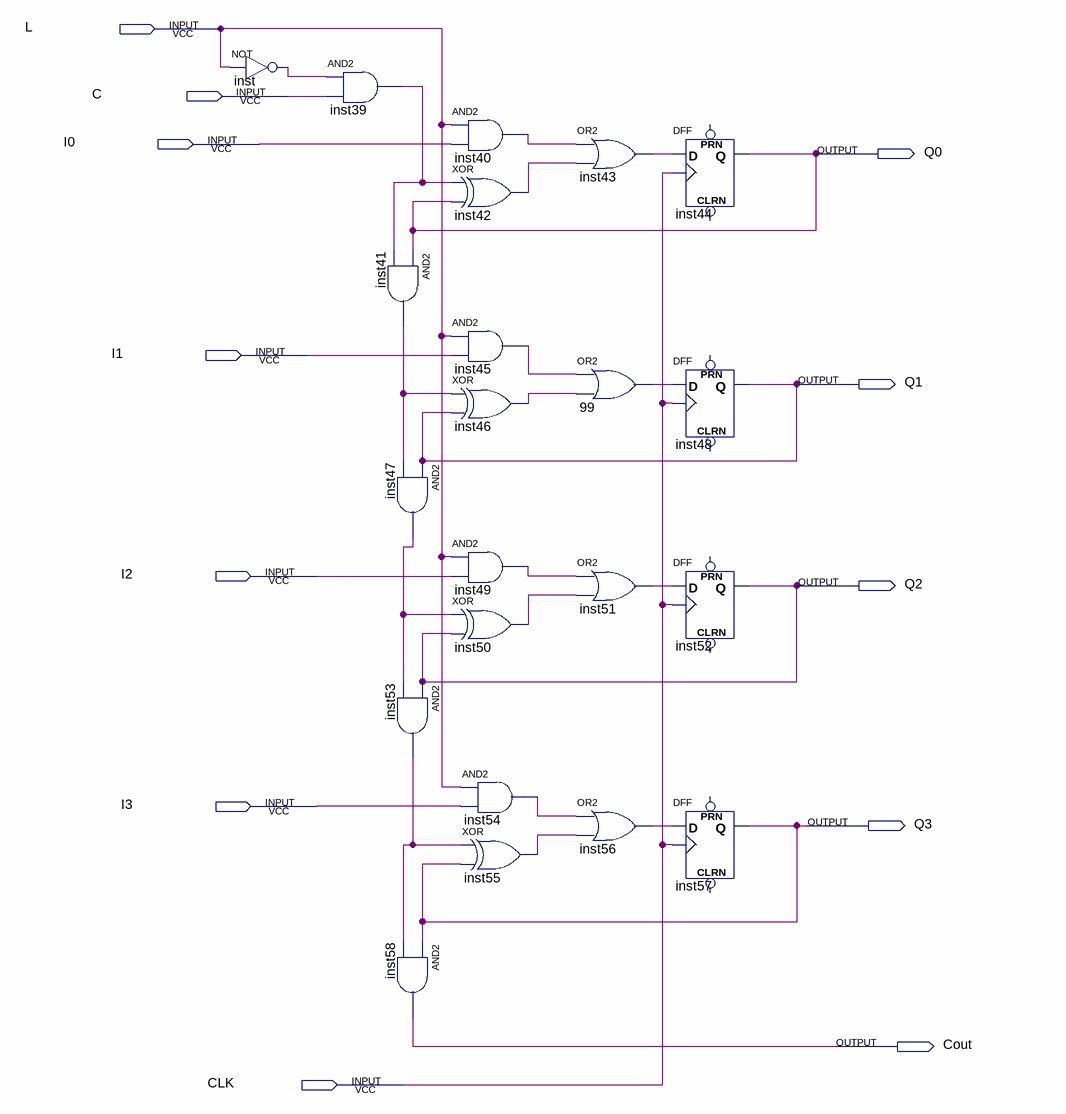
[diagram p0: schematic sheet]
// Quartus schematic binarydowncounter.bdf as structural Verilog: 22 symbols, 12 pins
module binarydowncounter (
  input  L,
  input  C,
  input  I0,
  input  I1,
  input  I2,
  input  I3,
  input  CLK,
  output Q0,
  output Q1,
  output Q2,
  output Q3,
  output Cout
);

  wire inst39_out, inst40_out, inst41_out, inst42_out, inst43_out, inst45_out, inst46_out, inst47_out,
       inst49_out, inst50_out, inst51_out, inst53_out, inst54_out, inst55_out, inst56_out, inst_out, n99_out;

  not inst (inst_out, L);
  and inst39 (inst39_out, inst_out, C);
  and inst41 (inst41_out, Q0, inst39_out);
  and inst47 (inst47_out, Q1, inst41_out);
  and inst53 (inst53_out, Q2, inst47_out);
  and inst58 (Cout, Q3, inst53_out);
  and inst40 (inst40_out, L, I0);
  xor inst42 (inst42_out, inst39_out, Q0);
  and inst45 (inst45_out, L, I1);
  xor inst46 (inst46_out, inst41_out, Q1);
  and inst49 (inst49_out, L, I2);
  xor inst50 (inst50_out, inst47_out, Q2);
  and inst54 (inst54_out, L, I3);
  xor inst55 (inst55_out, inst53_out, Q3);
  or inst43 (inst43_out, inst40_out, inst42_out);
  or u_99 (n99_out, inst45_out, inst46_out);
  or inst51 (inst51_out, inst49_out, inst50_out);
  or inst56 (inst56_out, inst54_out, inst55_out);
  DFF inst44 (.CLK(CLK), .D(inst43_out), .Q(Q0));  // open: CLRN, PRN
  DFF inst48 (.CLK(CLK), .D(n99_out), .Q(Q1));  // open: CLRN, PRN
  DFF inst52 (.CLK(CLK), .D(inst51_out), .Q(Q2));  // open: CLRN, PRN
  DFF inst57 (.CLK(CLK), .D(inst56_out), .Q(Q3));  // open: CLRN, PRN
endmodule
